# Altium project PCB_Project.PrjPcb
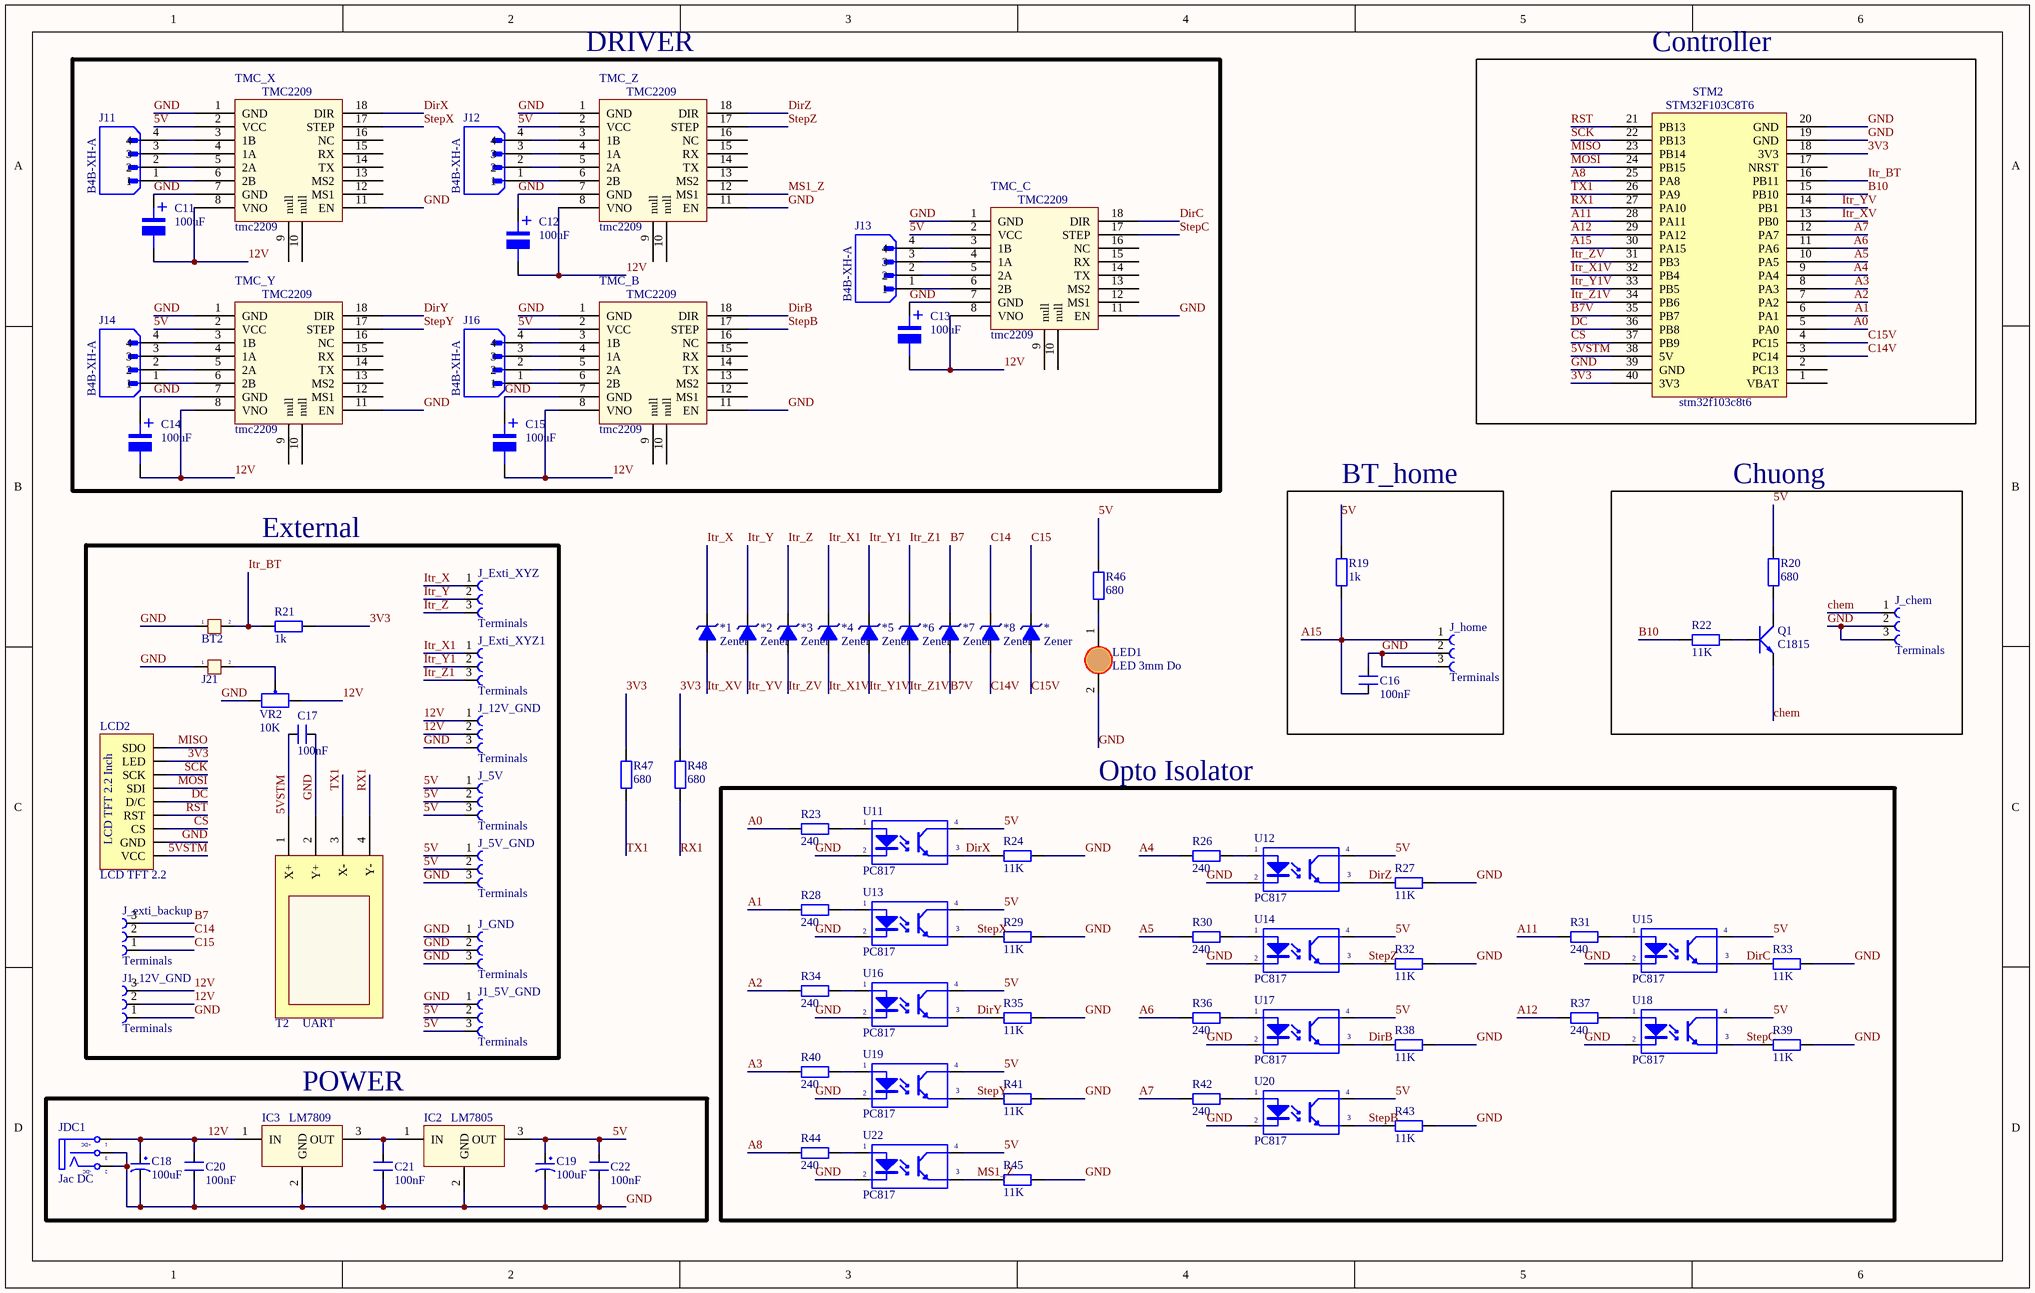
[diagram p0: sch_version2.SchDoc]
1 sheet, 93 parts. Net scope: global (net labels, ports and power ports of the same name join across sheets).
Board file: PCB_version2.PcbDoc

## Sheet sch_version2.SchDoc
size B; SheetNumber: 1; SheetTotal: 1

### Parts
*  Zener  [D1A]
*1  Zener  [D1A]
*2  Zener  [D1A]
*3  Zener  [D1A]
*4  Zener  [D1A]
*5  Zener  [D1A]
*6  Zener  [D1A]
*7  Zener  [D1A]
*8  Zener  [D1A]
BT2  Jumper 2  [jp2h]  (value not drawn)
C11  100uF  [tu nhom 6.3 (d)]
C12  100uF  [tu nhom 6.3 (d)]
C13  100uF  [tu nhom 6.3 (d)]
C14  100uF  [tu nhom 6.3 (d)]
C15  100uF  [tu nhom 6.3 (d)]
C16  100nF  [CN2]
C17  100nF  [CN2]
C18  100uF  [CP1.5/3.4]
C19  100uF  [CP1.5/3.4]
C20  100nF  [CN2]
C21  100nF  [CN2]
C22  100nF  [CN2]
IC2  LM7805  [QTO-220]
IC3  LM7809  [QTO-220]
J1_5V_GND  Terminals  [691214110003]
J1_12V_GND  Terminals  [691214110003]
J11  B4B-XH-A  [JST_B4B-XH-A(LF)(SN)]
J12  B4B-XH-A  [JST_B4B-XH-A(LF)(SN)]
J13  B4B-XH-A  [JST_B4B-XH-A(LF)(SN)]
J14  B4B-XH-A  [JST_B4B-XH-A(LF)(SN)]
J16  B4B-XH-A  [JST_B4B-XH-A(LF)(SN)]
J21  Jumper 2  [jp2h]  (value not drawn)
J_5V  Terminals  [691214110003]
J_5V_GND  Terminals  [691214110003]
J_12V_GND  Terminals  [691214110003]
J_chem  Terminals  [691214110003]
J_exti_backup  Terminals  [691214110003]
J_Exti_XYZ  Terminals  [691214110003]
J_Exti_XYZ1  Terminals  [691214110003]
J_GND  Terminals  [691214110003]
J_home  Terminals  [691214110003]
JDC1  Jac DC  [DC-IN]
LCD2  LCD TFT 2.2  [JP9-C1T]
LED1  LED 3mm Do  [LED 3mm Do]
Q1  C1815  [QTO-92]
R19  1k  [R1/4W]
R20  680  [R1/4W]
R21  1k  [R1/4W]
R22  11K  [R1/4W]
R23  240  [R1/4W]
R24  11K  [R1/4W]
R26  240  [R1/4W]
R27  11K  [R1/4W]
R28  240  [R1/4W]
R29  11K  [R1/4W]
R30  240  [R1/4W]
R31  240  [R1/4W]
R32  11K  [R1/4W]
R33  11K  [R1/4W]
R34  240  [R1/4W]
R35  11K  [R1/4W]
R36  240  [R1/4W]
R37  240  [R1/4W]
R38  11K  [R1/4W]
R39  11K  [R1/4W]
R40  240  [R1/4W]
R41  11K  [R1/4W]
R42  240  [R1/4W]
R43  11K  [R1/4W]
R44  240  [R1/4W]
R45  11K  [R1/4W]
R46  680  [R1/4W]
R47  680  [R1/4W]
R48  680  [R1/4W]
STM2  stm32f103c8t6  [STM32F103]
T2  UART  [HDR1X4H]
TMC_B  tmc2209  [TMC2209]
TMC_C  tmc2209  [TMC2209]
TMC_X  tmc2209  [TMC2209]
TMC_Y  tmc2209  [TMC2209]
TMC_Z  tmc2209  [TMC2209]
U11  PC817  [DIP4/W0.3]
U12  PC817  [DIP4/W0.3]
U13  PC817  [DIP4/W0.3]
U14  PC817  [DIP4/W0.3]
U15  PC817  [DIP4/W0.3]
U16  PC817  [DIP4/W0.3]
U17  PC817  [DIP4/W0.3]
U18  PC817  [DIP4/W0.3]
U19  PC817  [DIP4/W0.3]
U20  PC817  [DIP4/W0.3]
U22  PC817  [DIP4/W0.3]
VR2  10K  [VR]

### Blocks framed on the sheet
DRIVER: C11-C15 J11-J14 J16 TMC_B TMC_C TMC_X TMC_Y TMC_Z
Controller: STM2
BT_home: C16 J_home R19
Chuong: J_chem Q1 R20 R22
External: BT2 C17 J1_5V_GND J1_12V_GND J21 J_5V J_5V_GND J_12V_GND J_exti_backup J_Exti_XYZ J_Exti_XYZ1 J_GND LCD2 R21 T2 VR2
Opto Isolator: R23 R24 R26-R45 U11-U20 U22
POWER: C18-C22 IC2 IC3 JDC1

### Nets
3V3: LCD2.8(LED) R21.2 R47.2 R48.2 STM2.18(3V3) STM2.40(3V3)
5V: C19.1 C22.2 IC2.3(OUT) J1_5V_GND.2 J1_5V_GND.3 J_5V.1 J_5V.2 J_5V.3 J_5V_GND.1 J_5V_GND.2 R19.2 R20.2 R46.2 TMC_B.2(VCC) TMC_C.2(VCC) TMC_X.2(VCC) TMC_Y.2(VCC) TMC_Z.2(VCC) U11.4(C) U12.4(C) U13.4(C) U14.4(C) U15.4(C) U16.4(C) U17.4(C) U18.4(C) U19.4(C) U20.4(C) U22.4(C)
5VSTM: C17.2 LCD2.1(VCC) STM2.38(5V) T2.1(X+)
12V: C11.2 C12.2 C13.2 C14.2 C15.2 C18.1 C20.2 IC3.1(IN) J1_12V_GND.2 J1_12V_GND.3 J_12V_GND.1 J_12V_GND.2 JDC1.1(T) TMC_B.8(VNO) TMC_C.8(VNO) TMC_X.8(VNO) TMC_Y.8(VNO) TMC_Z.8(VNO) VR2.3
A0: R23.1 STM2.5(PA0)
A1: R28.1 STM2.6(PA1)
A2: R34.1 STM2.7(PA2)
A3: R40.1 STM2.8(PA3)
A4: R26.1 STM2.9(PA4)
A5: R30.1 STM2.10(PA5)
A6: R36.1 STM2.11(PA6)
A7: R42.1 STM2.12(PA7)
A8: R44.1 STM2.25(PA8)
A11: R31.1 STM2.28(PA11)
A12: R37.1 STM2.29(PA12)
A15: C16.1 J_home.1 R19.1 STM2.30(PA15)
B7: *7.2(K) J_exti_backup.3
B7V: *7.1(A) STM2.35(PB7)
B10: R22.1 STM2.15(PB10)
C14: *8.2(K) J_exti_backup.2
C14V: *8.1(A) STM2.3(PC14)
C15: *.2(K) J_exti_backup.1
C15V: *.1(A) STM2.4(PC15)
chem: J_chem.1 Q1.1(E)
CS: LCD2.3(CS) STM2.37(PB9)
DC: LCD2.5(D/C) STM2.36(PB8)
DirB: R38.1 TMC_B.18(DIR) U17.3(E)
DirC: R33.1 TMC_C.18(DIR) U15.3(E)
DirX: R24.1 TMC_X.18(DIR) U11.3(E)
DirY: R35.1 TMC_Y.18(DIR) U16.3(E)
DirZ: R27.1 TMC_Z.18(DIR) U12.3(E)
GND: BT2.1 C11.1 C12.1 C13.1 C14.1 C15.1 C16.2 C17.1 C18.2 C19.2 C20.1 C21.1 C22.1 IC2.2(GND) IC3.2(GND) J1_5V_GND.1 J1_12V_GND.1 J21.1 J_5V_GND.3 J_12V_GND.3 J_chem.2 J_chem.3 J_GND.1 J_GND.2 J_GND.3 J_home.2 J_home.3 JDC1.2(TN) JDC1.3(S) LCD2.2(GND) LED1.2(K) R24.2 R27.2 R29.2 R32.2 R33.2 R35.2 R38.2 R39.2 R41.2 R43.2 R45.2 STM2.19(GND) STM2.20(GND) STM2.39(GND) T2.2(Y+) TMC_B.1(GND) TMC_B.7(GND) TMC_B.11(EN) TMC_C.1(GND) TMC_C.7(GND) TMC_C.11(EN) TMC_X.1(GND) TMC_X.7(GND) TMC_X.11(EN) TMC_Y.1(GND) TMC_Y.7(GND) TMC_Y.11(EN) TMC_Z.1(GND) TMC_Z.7(GND) TMC_Z.11(EN) U11.2(K) U12.2(K) U13.2(K) U14.2(K) U15.2(K) U16.2(K) U17.2(K) U18.2(K) U19.2(K) U20.2(K) U22.2(K) VR2.1
Itr_BT: BT2.2 R21.1 STM2.16(PB11)
Itr_X: *1.2(K) J_Exti_XYZ.1
Itr_X1: *4.2(K) J_Exti_XYZ1.1
Itr_X1V: *4.1(A) STM2.32(PB4)
Itr_XV: *1.1(A) STM2.13(PB0)
Itr_Y: *2.2(K) J_Exti_XYZ.2
Itr_Y1: *5.2(K) J_Exti_XYZ1.2
Itr_Y1V: *5.1(A) STM2.33(PB5)
Itr_YV: *2.1(A) STM2.14(PB1)
Itr_Z: *3.2(K) J_Exti_XYZ.3
Itr_Z1: *6.2(K) J_Exti_XYZ1.3
Itr_Z1V: *6.1(A) STM2.34(PB6)
Itr_ZV: *3.1(A) STM2.31(PB3)
MISO: LCD2.9(SDO) STM2.23(PB14)
MOSI: LCD2.6(SDI) STM2.24(PB15)
MS1_Z: R45.1 TMC_Z.12(MS1) U22.3(E)
RST: LCD2.4(RST) STM2.21(PB13)
RX1: R48.1 STM2.27(PA10) T2.4(Y-)
SCK: LCD2.7(SCK) STM2.22(PB13)
StepB: R43.1 TMC_B.17(STEP) U20.3(E)
StepC: R39.1 TMC_C.17(STEP) U18.3(E)
StepX: R29.1 TMC_X.17(STEP) U13.3(E)
StepY: R41.1 TMC_Y.17(STEP) U19.3(E)
StepZ: R32.1 TMC_Z.17(STEP) U14.3(E)
TX1: R47.1 STM2.26(PA9) T2.3(X-)
NetC21_2: C21.2 IC2.1(IN) IC3.3(OUT)
NetJ11_1: J11.1 TMC_X.6(2B)
NetJ11_2: J11.2 TMC_X.5(2A)
NetJ11_3: J11.3 TMC_X.4(1A)
NetJ11_4: J11.4 TMC_X.3(1B)
NetJ12_1: J12.1 TMC_Z.6(2B)
NetJ12_2: J12.2 TMC_Z.5(2A)
NetJ12_3: J12.3 TMC_Z.4(1A)
NetJ12_4: J12.4 TMC_Z.3(1B)
NetJ13_1: J13.1 TMC_C.6(2B)
NetJ13_2: J13.2 TMC_C.5(2A)
NetJ13_3: J13.3 TMC_C.4(1A)
NetJ13_4: J13.4 TMC_C.3(1B)
NetJ14_1: J14.1 TMC_Y.6(2B)
NetJ14_2: J14.2 TMC_Y.5(2A)
NetJ14_3: J14.3 TMC_Y.4(1A)
NetJ14_4: J14.4 TMC_Y.3(1B)
NetJ16_1: J16.1 TMC_B.6(2B)
NetJ16_2: J16.2 TMC_B.5(2A)
NetJ16_3: J16.3 TMC_B.4(1A)
NetJ16_4: J16.4 TMC_B.3(1B)
NetJ21_2: J21.2 VR2.2
NetLED1_1: LED1.1(A) R46.1
NetQ1_2: Q1.2(C) R20.1
NetQ1_3: Q1.3(B) R22.2
NetR23_2: R23.2 U11.1(A)
NetR26_2: R26.2 U12.1(A)
NetR28_2: R28.2 U13.1(A)
NetR30_2: R30.2 U14.1(A)
NetR31_2: R31.2 U15.1(A)
NetR34_2: R34.2 U16.1(A)
NetR36_2: R36.2 U17.1(A)
NetR37_2: R37.2 U18.1(A)
NetR40_2: R40.2 U19.1(A)
NetR42_2: R42.2 U20.1(A)
NetR44_2: R44.2 U22.1(A)

Not connected (* = marked no-connect by the designer): STM2 1(VBAT) 2(PC13) 17(NRST); TMC_B 9(null) 10(null) 12(MS1) 13(MS2) 14(TX) 15(RX) 16(NC); TMC_C 9(null) 10(null) 12(MS1) 13(MS2) 14(TX) 15(RX) 16(NC); TMC_X 9(null) 10(null) 12(MS1) 13(MS2) 14(TX) 15(RX) 16(NC); TMC_Y 9(null) 10(null) 12(MS1) 13(MS2) 14(TX) 15(RX) 16(NC); TMC_Z 9(null) 10(null) 13(MS2) 14(TX) 15(RX) 16(NC)

### Notes on the sheet
- (in symbol DCIN) +DC; -DC
- (in symbol Driver_TMC2209) TMC2209
- (in symbol LCD TFT 2.2) LCD TFT 2.2 Inch
- (in symbol STM32F103) STM32F103C8T6
- (in symbol Tu Nhom 100uF 16V) +

### Library data of the parts
BT2 J21 = JP 2: Value: JP 2
C11-C15 = Tu Nhom 100uF 16V: Dán; Don_Vi: Con; So_Chan: 2; Ten_Linh_Kien: Tụ Nhôm 100uF 16V 6.3x5.4MM; Ma_Hang: MH002219; Chung_Loai: Dán; Kieu_Chan: *
C16 C17 C20-C22 = CN2: Cap np 104 => 105pF; Value: 0.1uF
C18 C19 = CP3: Cap 100uF/35V - 470uF/16V; Value: 100uF/35V/50V; Description 1: 1000uF/6,3V - 470uF/16V - 330uF - 25V; Description 2: 220uF/35V - 100uF/50V - 63V - 4,7uF/200V; Description 3: 22uF => 33uF100V - 3,3uF => 4,7uF/250V; Description 4: 2,2uF =>3,3uF/350 - 2,2uF/400V - 1uF/450V
IC2 = LM78xx: On ap +, from + 5 to + 24VDC; Value: LM7805
IC3 = LM78xx: On ap +, from + 5 to + 24VDC; Value: LM7805
J1_5V_GND J1_12V_GND J_5V J_5V_GND J_12V_GND J_chem J_exti_backup J_Exti_XYZ J_Exti_XYZ1 J_GND J_home = 691214110003: 3 Position Wire to Board Terminal Block Horizontal with Board 0.138 (3.50mm) Through Hole; MF: Wurth Elektronik; MP: 691214110003; Value: *; SnapEDA_Link: https://www.snapeda.com/parts/691214110003/Wurth+Elektronik/view-part/?ref=snap; Package: None; Availability: In Stock; Purchase-URL: https://pricing.snapeda.com/search/part/691214110003/?ref=eda; Check_prices: https://www.snapeda.com/parts/691214110003/Wurth+Elektronik/view-part/?ref=eda; Price: None
J11-J14 J16 = B4B-XH-A(LF)(SN): Price: None; MP: B4B-XH-A(LF)(SN); Value: *; Availability: Unavailable; Package: None
JDC1 = DCIN: Jac DC input; Value: Jac DC
LCD2 = LCD TFT 2.2: Manufacturer: W¨¹rth Elektronik eiSos GmbH; partNo: 613009143121; ComponentLink1 Description: Manufacturer; ComponentLink2 Description: Datasheet; NoPins: 09; Created Date: 29 March 2013; ComponentLink1URL: http://www.we-online.com; ComponentLink2URL: http://katalog.we-online.de/em/datasheet/6130xx143121.pdf; Created by: Karrer Zheng
LED1 = LED 3mm Do: Cắm; Ten_Linh_Kien: LED 3MM Sáng Đỏ ( SS); Ma_Hang: MH004931; Don_Vi: Con; Ghi_Chu: *; Kieu_Chan: *; Chung_Loai: Cắm
Q1 = C1815: NPN 600mW, ECB; Value: C1815
R19-R24 R26-R48 = R1/4W: Resistor 1/4W; Value: R1/4W - 1K
STM2 = STM32F103
T2 = TouchPanel: 4 wires; Creator: Nguyen Ba Bien; Date Created: 14-04-2010
TMC_B TMC_C TMC_X TMC_Y TMC_Z = Driver_TMC2209
U11-U20 U22 = PC817: Single Opto; Value: PC817
VR2 = VR: Var Resistor; Value: VR 10K